# Altium schematic sheet adu.SchDoc
size A4; SheetNumber: 1; SheetTotal: 11
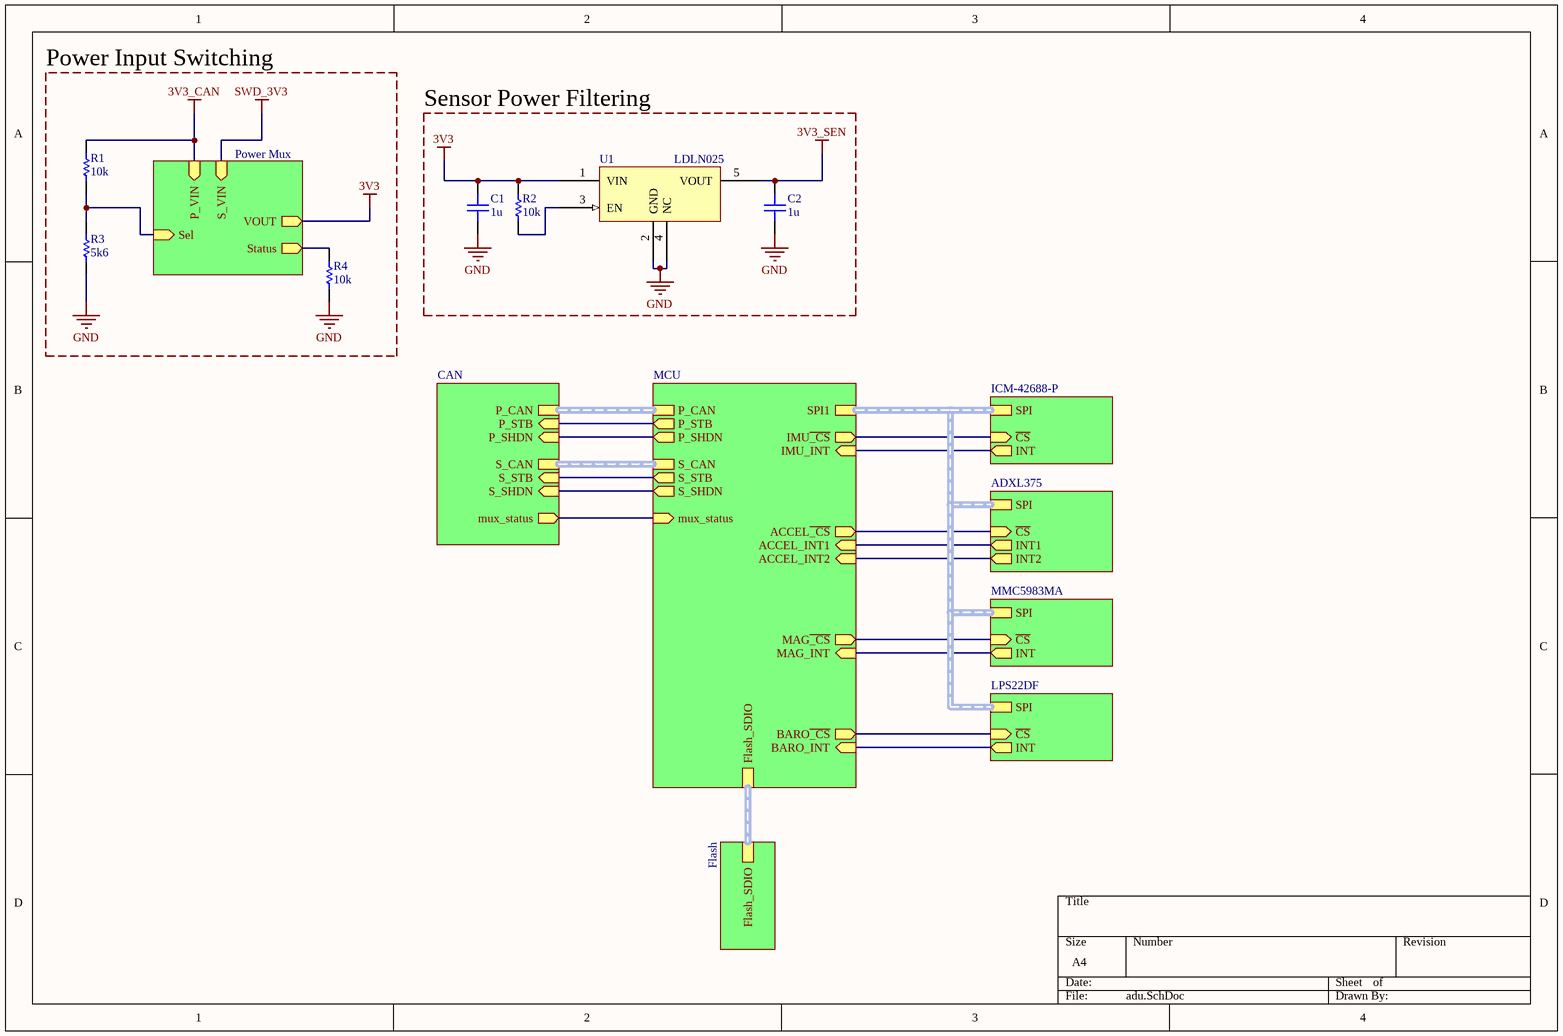
[diagram p0: adu.SchDoc]

## Parts
C1  1u  [CAP-0603-NP]
C2  1u  [CAP-0603-NP]
R1  10k  [RES-0603]
R2  10k  [RES-0603]
R3  5k6  [RES-0603]
R4  10k  [RES-0603]
U1  LDLN025  [ST SOT23-5L]

## Blocks framed on the sheet
Power Input Switching: R1 R3 R4
Sensor Power Filtering: C1 C2 R2 U1

## Sub-sheets
ADXL375 = adxl375: SPI (harness SPI), ~{CS} (in), INT1 (out), INT2 (out)
CAN = CAN_bus_powered: P_CAN (harness CAN), P_STB (in), P_SHDN (in), S_CAN (harness CAN), S_STB (in), S_SHDN (in), mux_status (out)
Flash = flash: Flash_SDIO (harness SDIO)
ICM-42688-P = icm-42688-p: SPI (harness SPI), ~{CS} (in), INT (out)
LPS22DF = lps22df: INT (out), SPI (harness SPI), ~{CS} (in)
MCU = mcu: Flash_SDIO (harness SDIO), SPI1 (harness SPI), mux_status (in), P_STB (out), P_SHDN (out), S_STB (out), S_SHDN (out), S_CAN (harness CAN), P_CAN (harness CAN), IMU~{_CS} (out), IMU_INT (in), ACCEL~{_CS} (out), ACCEL_INT2 (in), ACCEL_INT1 (in), MAG~{_CS} (out), MAG_INT (in), BARO~{_CS} (out), BARO_INT (in)
MMC5983MA = mmc5983ma: INT (out), SPI (harness SPI), ~{CS} (in)
Power Mux = power_mux: P_VIN (in), S_VIN (in), Sel (in), VOUT (out), Status (out)

## Nets
3V3: C1.2 R2.2 U1.1(VIN) ; sheet Power Mux/VOUT
3V3_CAN: R1.2 ; sheet Power Mux/P_VIN
3V3_SEN: C2.2 U1.5(VOUT)
GND: C1.1 C2.1 R3.1 R4.1 U1.2(GND) U1.4(NC)
SWD_3V3: sheet Power Mux/S_VIN
NetR1_1: R1.1 R3.2 ; sheet Power Mux/Sel
NetR2_1: R2.1 U1.3(EN)
NetR4_2: R4.2 ; sheet Power Mux/Status
(unnamed): sheet MCU/mux_status, sheet CAN/mux_status
(unnamed): sheet MCU/P_STB, sheet CAN/P_STB
(unnamed): sheet MCU/P_SHDN, sheet CAN/P_SHDN
(unnamed): sheet MCU/S_STB, sheet CAN/S_STB
(unnamed): sheet MCU/S_SHDN, sheet CAN/S_SHDN
(unnamed): sheet MCU/IMU~{_CS}, sheet ICM-42688-P/~{CS}
(unnamed): sheet MCU/IMU_INT, sheet ICM-42688-P/INT
(unnamed): sheet MCU/ACCEL~{_CS}, sheet ADXL375/~{CS}
(unnamed): sheet MCU/ACCEL_INT2, sheet ADXL375/INT2
(unnamed): sheet MCU/ACCEL_INT1, sheet ADXL375/INT1
(unnamed): sheet MCU/MAG~{_CS}, sheet MMC5983MA/~{CS}
(unnamed): sheet MCU/MAG_INT, sheet MMC5983MA/INT
(unnamed): sheet MCU/BARO~{_CS}, sheet LPS22DF/~{CS}
(unnamed): sheet MCU/BARO_INT, sheet LPS22DF/INT

## Buses and harness runs
harness sheet ADXL375/SPI = sheet ICM-42688-P/SPI = sheet LPS22DF/SPI = sheet MCU/SPI1 = sheet MMC5983MA/SPI
harness sheet CAN/P_CAN = sheet MCU/P_CAN
harness sheet CAN/S_CAN = sheet MCU/S_CAN
harness sheet Flash/Flash_SDIO = sheet MCU/Flash_SDIO

## Library data of the parts
C1 C2 = Capacitor
R1-R4 = Resistor
U1 = LDLN025: 250 mA ultra low noise LDO